# EAGLE design dream-machine (EAGLE 6.1)
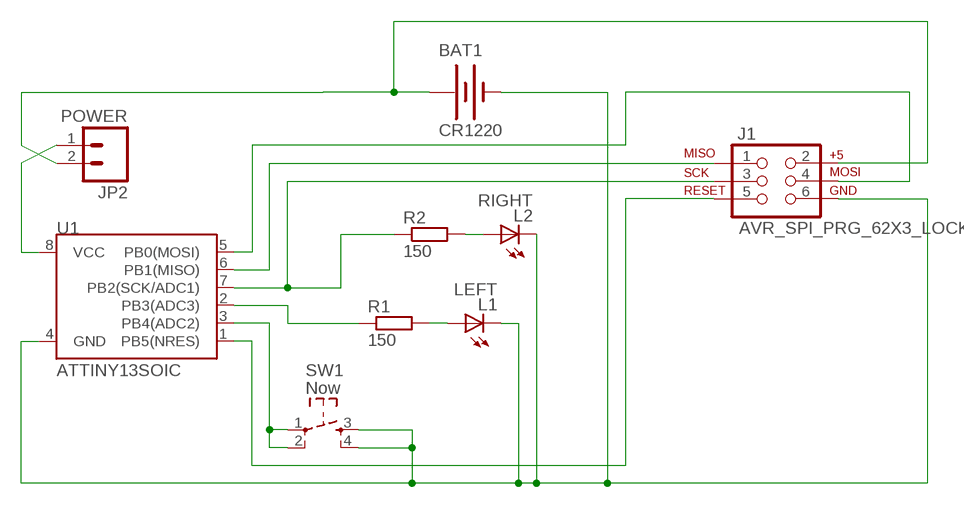
[diagram p0: schematic, sheet 1]

## Parts
BAT1  CR1220  BATTERY12MM  [BATTCON_12MM]
J1  AVR_SPI_PRG_62X3_LOCK  [2X3_LOCK]
JP2  POWER  M02LOCK  [1X02_LOCK]
L1  LEFT  LED-3MM  [LED-3MM]
L2  RIGHT  LED-3MM  [LED-3MM]
R1  150  RESISTORR805-0805  [R805]
R2  150  RESISTORR805-0805  [R805]
SW1  Now  SW_TACT  [SW_TACT_SMALL]
U1  ATTINY13SOIC  [SO08]

## Nets
/RESET: J1.5 U1.1(PB5(NRES))
GND: BAT1.GND(-) J1.6 L1.K(C) L2.K(C) SW1.3 SW1.4 U1.4(GND)
L1-R: L1.A R1.2
L2-R: L2.A R2.2
MISO: J1.1 U1.6(PB1(MISO))
MOSI: J1.4 U1.5(PB0(MOSI))
PB2/SCK: J1.3 R2.1 U1.7(PB2(SCK/ADC1))
PB3: R1.1 U1.2(PB3(ADC3))
PB4: SW1.1 SW1.2 U1.3(PB4(ADC2))
VCC: BAT1.PWR@1(+) J1.2 JP2.2
VCC-POWER: JP2.1 U1.8(VCC)

## Library data of the parts
BAT1 = SparkFun:BATTERY: Battery Holders Various common sizes : AA, AAA, 20mm coin cell and 12mm coin cell.
J1 = SparkFun:AVR_SPI_PRG_6: AVR ISP 6 Pin This is the reduced ISP connector for AVR programming. Common on Arduino. This footprint will take up less PCB space and can be used with a 10-pin to 6-pin adapter such as SKU: BOB-08508
JP2 = SparkFun:M02: Header 2 Standard 2-pin 0.1" header. Use with straight break away headers (SKU : PRT-00116), right angle break away headers (PRT-00553), swiss pins (PRT-00743), machine pins (PRT-00117), and female headers (PRT-00115). Molex polarized connector foot print use with SKU : PRT-08233 with associated crimp pins and housings.
L1 L2 = dp_devices:LED: Light Emitting Diode
R1 R2 = dp_devices:RESISTOR
SW1 = dp_devices:SW_TACT
U1 = SparkFun:ATTINY13

## Board
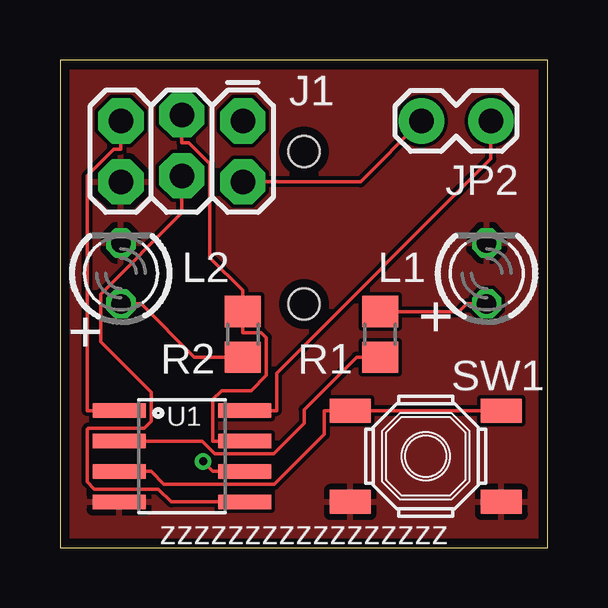
[diagram p1: board, top side]
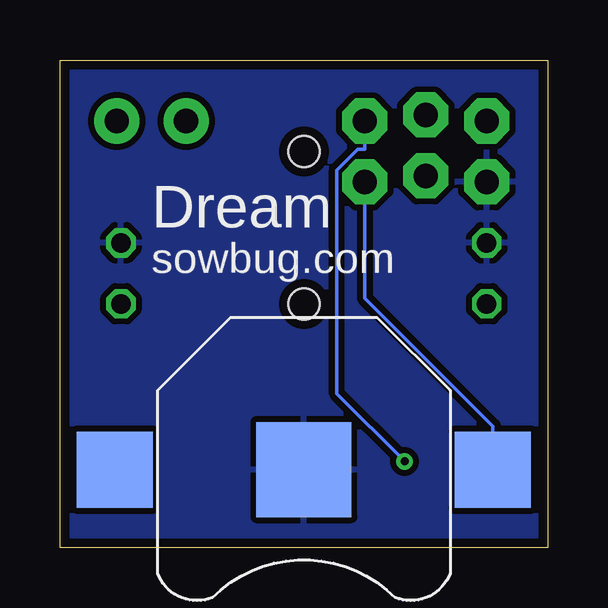
[diagram p2: board, bottom side, seen from below]

Size 20.32 x 20.32 mm. Coordinates in mm from the lower left corner, seen from the top.
Outline: 20.32,0 20.32,20.32 0,20.32 0,0 20.32,0
Copper layers (1*16): Top 0.0356mm / dielectric 1.5011mm / Bottom 0.0356mm
Design rules: minimum track width 6mil, minimum drill 13mil, track to track 6mil, track to pad 6mil, pad to pad 6mil, via to via 6mil, smd to smd 6mil, copper to edge 15mil, drill to drill 6mil, minimum pad ring 7mil, minimum via ring 7mil, stop-mask expansion 4mil, vias tented up to drill 0mil, thermal gap 10mil
Holes 1.3 mm at 10.16,16.51 10.16,10.16

### Footprints (pad centres in the part's own frame; a part is rotated, then mirrored left to right if it is on the bottom)
BATTCON_12MM = smd 3.962 x 3.962: GND 0,0 | smd 3.175 x 3.175: PWR@1 -7.874,0; PWR@2 7.874,0
2X3_LOCK = drill 1.016 pad 1.88 octagon: 1 0,0; 2 0,2.54; 3 2.54,-0.254; 4 2.54,2.286; 5 5.08,0; 6 5.08,2.54
1X02_LOCK = drill 1.016 pad 1.88: 1 -0.178,0; 2 2.718,0
LED-3MM = drill 0.813 octagon: A -1.27,0; K 1.27,0
R805 = smd 1.3 x 1.5: 1 -0.95,0; 2 0.95,0
SW_TACT_SMALL = smd 1.7 x 1: 1 -3.15,1.9; 2 3.15,1.9; 3 -3.15,-1.9; 4 3.15,-1.9
SO08 = smd 0.61 x 2.21: 1 -1.905,-2.616; 2 -0.635,-2.616; 3 0.635,-2.616; 4 1.905,-2.616; 5 1.905,2.616; 6 0.635,2.616; 7 -0.635,2.616; 8 -1.905,2.616

### Placement (x,y rotation side)
BAT1  10.16,3.25 180 bottom
J1  7.62,17.78 180 top
JP2  17.78,17.78 180 top
L1  17.78,11.43 90 top
L2  2.54,11.43 90 top
R1  13.34,8.89 90 top
R2  7.62,8.89 270 top
SW1  15.24,3.81 0 top
U1  5.08,3.81 270 top

### Tracks (layer width: path | path; a pad name or v marks a point on that pad's centre or on a via)
/RESET
  Top 0.152: J1.5 2.54,16.61 2.25,16.61 1.13,15.49 1.13,5.71 U1.1
GND
  pour Bottom (isolate 0.254): -1.27,-1.27 -1.27,21.59 22.86,21.59 22.86,-1.27
  pour Top: -1.27,-1.27 -1.27,21.59 21.59,21.59 21.59,-1.27
L1-R
  Top 0.152: L1.A 16.94,10.16 16.62,9.84 R1.2
L2-R
  Top 0.152: L2.A 3.38,10.16 5.6,7.94 R2.2
MISO  (via drill 0.33 pad 0.69)
  Top 0.152: U1.6 6.36,3.17 6.36,3.19 v5.96,3.59
  Bottom 0.152: J1.1 7.62,16.61 7.91,16.61 8.79,15.73 8.79,6.42 v5.96,3.59
MOSI
  Top 0.152: U1.5 4.64,1.91 4.1,2.44 1.43,2.44 1.13,2.74 1.13,4.93 1.18,4.98 3.52,4.98 3.8,5.26 3.8,6.47 1.69,8.57 1.69,10.57 5.08,13.96 J1.4
PB2/SCK
  Top 0.152: U1.7 6.36,4.45 6.36,6.18 6.73,6.55 7.96,6.55 8.6,7.19 8.6,8.75 8.39,8.96 7.62,8.96 R2.1 7.62,10.72 6.25,12.09 6.25,15.99 5.37,16.87 5.08,16.87 J1.3
PB3
  Top 0.152: R1.1 12.36,7.94 10.17,5.76 10.17,5.18 8.91,3.91 6.45,3.91 5.92,4.45 3.8,4.45 U1.2
PB4
  Top 0.152: U1.3 3.8,3.17 4.33,2.64 8.93,2.64 11.01,4.72 11.01,5.71 SW1.1 SW1.2
VCC
  Top 0.152: JP2.2 12.52,15.24 J1.2
  Bottom 0.152: BAT1.PWR@1 2.29,5.07 7.62,10.4 J1.2
VCC-POWER
  Top 0.152: U1.8 9.03,5.71 9.03,7.28 17.96,16.2 JP2.1

### Text on the board
tPlace: + | + | zzzzzzzzzzzzzzzzz
bNames: Dream | sowbug.com